# Altium schematic sheet Controller.SchDoc
size A4
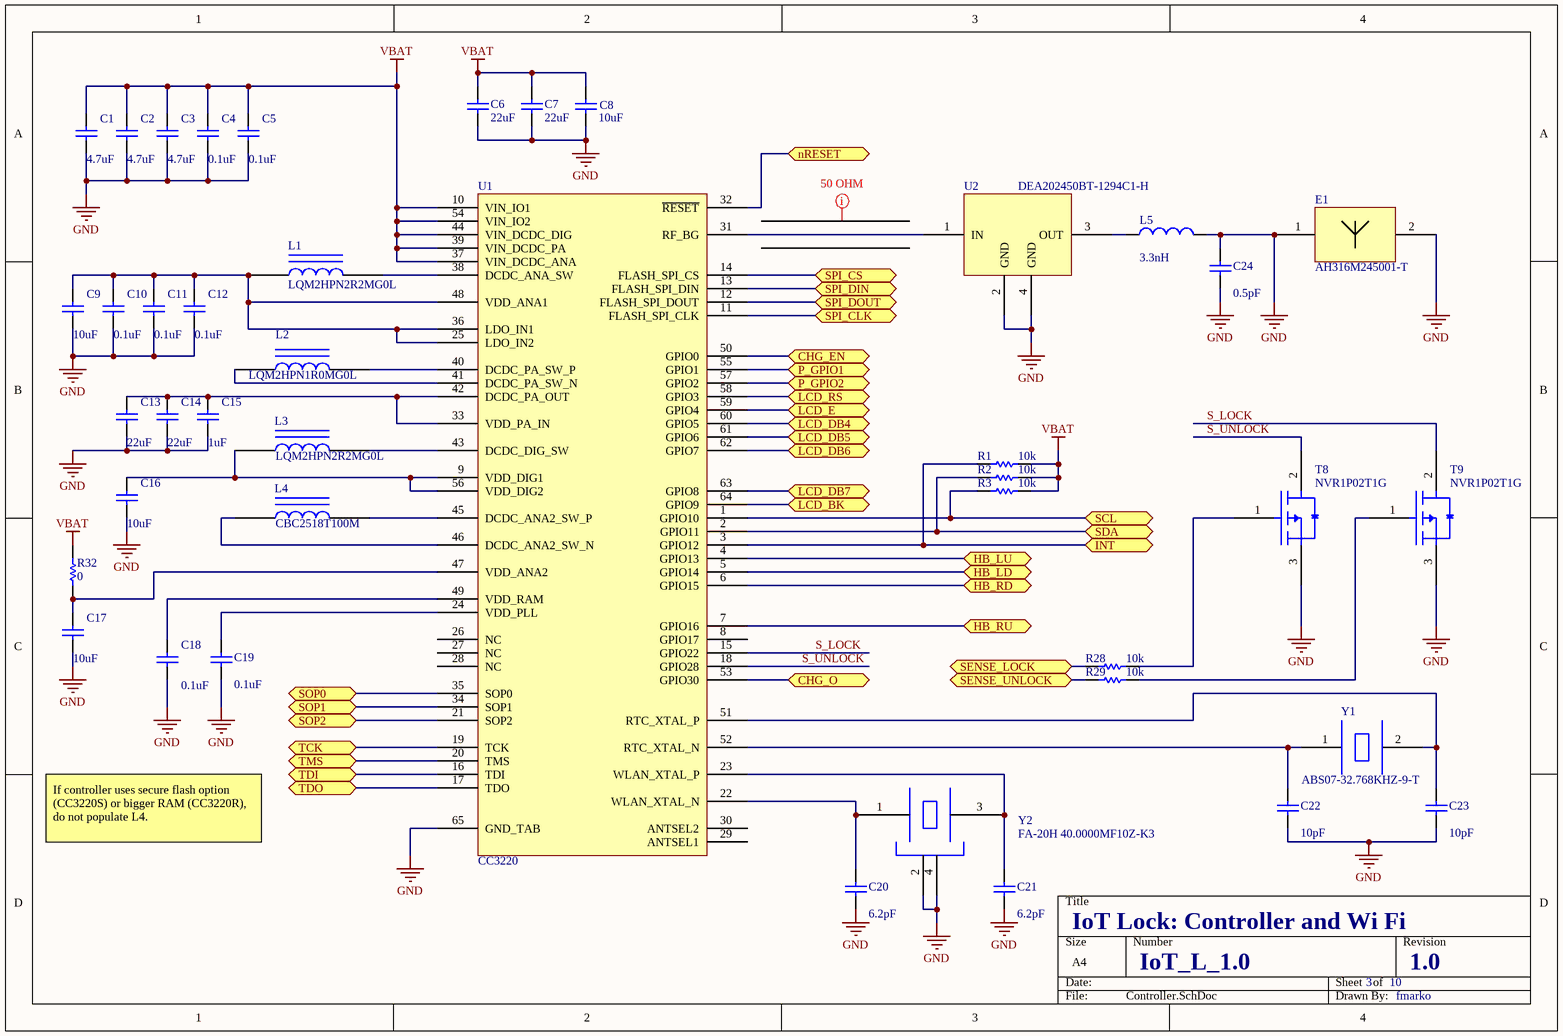
[diagram p0: Controller.SchDoc]

## Parts
C1  value 4.7uF  [0402]  (hidden comment: GRM1555C1HR50BA01D)
C2  value 4.7uF  [0402]  (hidden comment: GRM1555C1HR50BA01D)
C3  value 4.7uF  [0402]  (hidden comment: GRM1555C1HR50BA01D)
C4  value 0.1uF  [0402]  (hidden comment: GRM1555C1HR50BA01D)
C5  value 0.1uF  [0402]  (hidden comment: GRM1555C1HR50BA01D)
C6  value 22uF  [1608[0603]]  (hidden comment: GRM1555C1HR50BA01D)
C7  value 22uF  [1608[0603]]  (hidden comment: GRM1555C1HR50BA01D)
C8  value 10uF  [1608[0603]]  (hidden comment: GRM1555C1HR50BA01D)
C9  value 10uF  [1608[0603]]  (hidden comment: GRM1555C1HR50BA01D)
C10  value 0.1uF  [0402]  (hidden comment: GRM1555C1HR50BA01D)
C11  value 0.1uF  [0402]  (hidden comment: GRM1555C1HR50BA01D)
C12  value 0.1uF  [0402]  (hidden comment: GRM1555C1HR50BA01D)
C13  value 22uF  [1608[0603]]  (hidden comment: GRM1555C1HR50BA01D)
C14  value 22uF  [1608[0603]]  (hidden comment: GRM1555C1HR50BA01D)
C15  value 1uF  [0402]  (hidden comment: GRM1555C1HR50BA01D)
C16  value 10uF  [1608[0603]]  (hidden comment: GRM1555C1HR50BA01D)
C17  value 10uF  [1608[0603]]  (hidden comment: GRM1555C1HR50BA01D)
C18  value 0.1uF  [0402]  (hidden comment: GRM1555C1HR50BA01D)
C19  value 0.1uF  [0402]  (hidden comment: GRM1555C1HR50BA01D)
C20  value 6.2pF  [0402]  (hidden comment: GRM1555C1HR50BA01D)
C21  value 6.2pF  [0402]  (hidden comment: GRM1555C1HR50BA01D)
C22  value 10pF  [0402]  (hidden comment: GRM1555C1HR50BA01D)
C23  value 10pF  [0402]  (hidden comment: GRM1555C1HR50BA01D)
C24  value 0.5pF  [0402]  (hidden comment: GRM1555C1HR50BA01D)
E1  AH316M245001-T  [AH316M245001-T]
L1  LQM2HPN2R2MG0L  [INDC2520X10N]
L2  LQM2HPN1R0MG0L  [INDC2520X10N]
L3  LQM2HPN2R2MG0L  [INDC2520X10N]
L4  CBC2518T100M  [INDC2518X20N]
L5  value 3.3nH  [0402-A]  (hidden comment: LQG15HS3N3S02D)
R1  value 10k  [0402]  (hidden comment: Res Semi)
R2  value 10k  [0402]  (hidden comment: Res Semi)
R3  value 10k  [0402]  (hidden comment: Res Semi)
R28  value 10k  [0402]  (hidden comment: Res Semi)
R29  value 10k  [0402]  (hidden comment: Res Semi)
R32  value 0  [0402]  (hidden comment: Res Semi)
T8  NVR1P02T1G  [SOT95P237X111-3N]
T9  NVR1P02T1G  [SOT95P237X111-3N]
U1  CC3220  [PQFN50P900X900X100_HS-65N]
U2  DEA202450BT-1294C1-H  [DEA202450BT-1294C1-H_LAYOUT]
Y1  ABS07-32.768KHZ-9-T  [ABS07-32.768KHZ-9-T_HS]
Y2  FA-20H 40.0000MF10Z-K3  [FA-20H 40.0000MF10Z-K3_HS]

## Ports
CHG_EN, CHG_O, HB_LD, HB_LU, HB_RD, HB_RU, INT, LCD_BK, LCD_DB4, LCD_DB5, LCD_DB6, LCD_DB7, LCD_E, LCD_RS, nRESET, P_GPIO1, P_GPIO2, SCL, SDA, SENSE_LOCK, SENSE_UNLOCK, SOP0, SOP1, SOP2, SPI_CLK, SPI_CS, SPI_DIN, SPI_DOUT, TCK, TDI, TDO, TMS

## Nets
GND: C1.1 C2.1 C3.1 C4.1 C5.1 C6.1 C7.1 C8.1 C9.1 C10.1 C11.1 C12.1 C13.1 C14.1 C15.1 C16.1 C17.1 C18.1 C19.1 C20.1 C21.1 C22.1 C23.1 C24.1 C24.2 E1.1 E1.2 L5.2 T8.3(D) T9.3(D) U1.65(GND_TAB) U2.2(GND) U2.4(GND) Y2.2 Y2.4
VBAT: C1.2 C2.2 C3.2 C4.2 C5.2 C6.2 C7.2 C8.2 R1.2 R2.2 R3.2 R32.2 U1.10(VIN_IO1) U1.37(VIN_DCDC_ANA) U1.39(VIN_DCDC_PA) U1.44(VIN_DCDC_DIG) U1.54(VIN_IO2)
CHG_EN: U1.50(GPIO0) ; port CHG_EN
CHG_O: U1.53(GPIO30) ; port CHG_O
HB_LD: U1.5(GPIO14) ; port HB_LD
HB_LU: U1.4(GPIO13) ; port HB_LU
HB_RD: U1.6(GPIO15) ; port HB_RD
HB_RU: U1.7(GPIO16) ; port HB_RU
INT: R1.1 U1.3(GPIO12) ; port INT
LCD_BK: U1.64(GPIO9) ; port LCD_BK
LCD_DB4: U1.60(GPIO5) ; port LCD_DB4
LCD_DB5: U1.61(GPIO6) ; port LCD_DB5
LCD_DB6: U1.62(GPIO7) ; port LCD_DB6
LCD_DB7: U1.63(GPIO8) ; port LCD_DB7
LCD_E: U1.59(GPIO4) ; port LCD_E
LCD_RS: U1.58(GPIO3) ; port LCD_RS
nRESET: U1.32(~{RESET}) ; port nRESET
P_GPIO1: U1.55(GPIO1) ; port P_GPIO1
P_GPIO2: U1.57(GPIO2) ; port P_GPIO2
S_LOCK: T9.2(S) U1.15(GPIO22)
S_UNLOCK: T8.2(S) U1.18(GPIO28)
SCL: R3.1 U1.1(GPIO10) ; port SCL
SDA: R2.1 U1.2(GPIO11) ; port SDA
SENSE_LOCK: R28.1 ; port SENSE_LOCK
SENSE_UNLOCK: R29.1 ; port SENSE_UNLOCK
SOP0: U1.35(SOP0) ; port SOP0
SOP1: U1.34(SOP1) ; port SOP1
SOP2: U1.21(SOP2) ; port SOP2
SPI_CLK: U1.11(FLASH_SPI_CLK) ; port SPI_CLK
SPI_CS: U1.14(FLASH_SPI_CS) ; port SPI_CS
SPI_DIN: U1.13(FLASH_SPI_DIN) ; port SPI_DIN
SPI_DOUT: U1.12(FLASH_SPI_DOUT) ; port SPI_DOUT
TCK: U1.19(TCK) ; port TCK
TDI: U1.16(TDI) ; port TDI
TDO: U1.17(TDO) ; port TDO
TMS: U1.20(TMS) ; port TMS
NetC9_2: C9.2 C10.2 C11.2 C12.2 L1.1 U1.25(LDO_IN2) U1.36(LDO_IN1) U1.48(VDD_ANA1)
NetC13_2: C13.2 C14.2 C15.2 U1.33(VDD_PA_IN) U1.42(DCDC_PA_OUT)
NetC16_2: C16.2 L3.1 U1.9(VDD_DIG1) U1.56(VDD_DIG2)
NetC17_2: C17.2 R32.1 U1.47(VDD_ANA2)
NetC18_2: C18.2 U1.49(VDD_RAM)
NetC19_2: C19.2 U1.24(VDD_PLL)
NetC20_2: C20.2 U1.22(WLAN_XTAL_N) Y2.1
NetC21_2: C21.2 U1.23(WLAN_XTAL_P) Y2.3
NetC22_2: C22.2 U1.52(RTC_XTAL_N) Y1.1
NetC23_2: C23.2 U1.51(RTC_XTAL_P) Y1.2
NetL1_2: L1.2 U1.38(DCDC_ANA_SW)
NetL2_1: L2.1 U1.41(DCDC_PA_SW_N)
NetL2_2: L2.2 U1.40(DCDC_PA_SW_P)
NetL3_2: L3.2 U1.43(DCDC_DIG_SW)
NetL4_1: L4.1 U1.46(DCDC_ANA2_SW_N)
NetL4_2: L4.2 U1.45(DCDC_ANA2_SW_P)
NetL5_1: L5.1 U2.3(OUT)
NetR28_2: R28.2 T8.1(G)
NetR29_2: R29.2 T9.1(G)
NetU1_31: U1.31(RF_BG) U2.1(IN)

Not connected (* = marked no-connect by the designer): U1 8(GPIO17) 26(NC) 27(NC) 28(NC) 29(ANTSEL1) 30(ANTSEL2)

## Layout directives
rule Undefined: (no net found under the mark)

## Notes on the sheet
- If controller uses secure flash option (CC3220S) or bigger RAM (CC3220R),
  do not populate L4.
- IoT Lock: Controller and Wi Fi
- IoT_L_1.0
- 3
- 10
- 1.0
- fmarko

## Library data of the parts
C1-C24 = Cap: Capacitor; Published: 8-Jun-2000; LatestRevisionDate: 17-Jul-2002; LatestRevisionNote: Re-released for DXP Platform.; PackageReference: RAD-0.3; Publisher: Altium Limited; PackageDescription: Radial Cap, Thru-Hole; 2 Leads; 0.3 in Pin Spacing
E1 = AH316M245001-T: 2.4 GHz Antenna
L1-L3 = LQM2HPN2R2MG0L: Murata 2.2uH inductor
L4 = CBC2518T100M: 10 uH inductor, Taiyo Yuden
L5 = Inductor: Code_IEC: 1005; Published: 8-Jun-2000; LatestRevisionDate: 29-May-2009; LatestRevisionNote: IPC-7351 Footprint Added.; PackageReference: 0402-A; Publisher: Altium Limited; PackageDescription: Chip Inductor; Code_JEITA: 0402
R1-R3 R28 R29 R32 = Res Semi: Semiconductor Resistor; Published: 8-Jun-2000; LatestRevisionDate: 17-Jul-2002; LatestRevisionNote: Re-released for DXP Platform.; PackageReference: AXIAL-0.5; Publisher: Altium Limited; PackageDescription: Axial Device, Thru-Hole; 2 Leads; 0.5 in Pin Spacing
T8 T9 = NVR1P02T1G: P-Channel MOSFET
U1 = CC3220: WiFi IoT controller, TI
Y1 = ABS07-32.768KHZ-9-T: 32.768 kHz Crystal, Abracon LLC
Y2 = FA-20H 40.0000MF10Z-K3: Crystal, 40 MHz, 10pF, Epson